# EAGLE design LCD_Breakout (EAGLE 7.6.0)
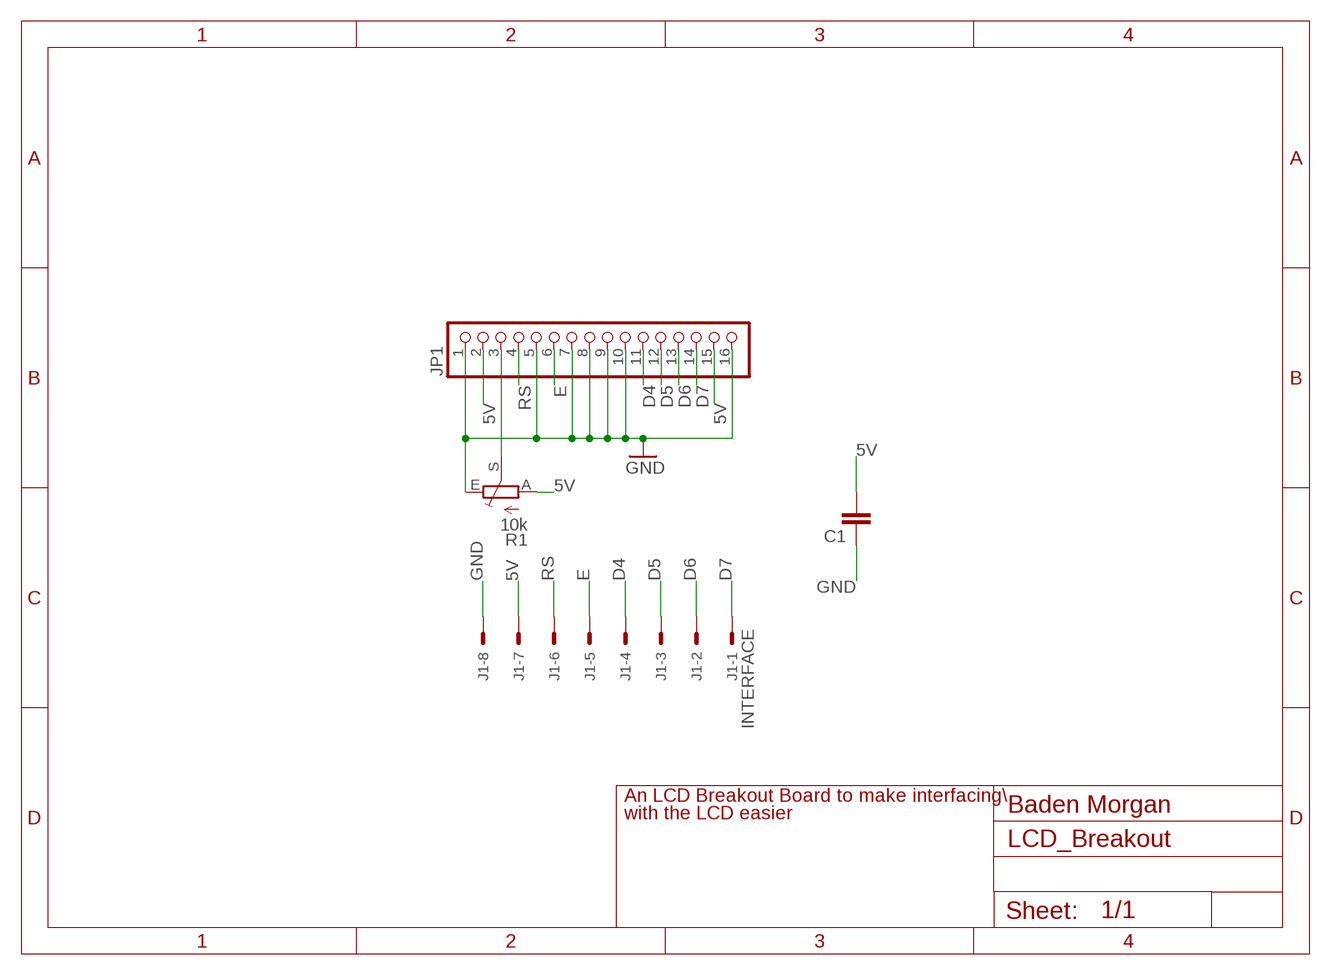
[diagram p0: schematic, sheet 1]

## Parts
C1  C5/2.5  [C5B2.5]
J1  INTERFACE  22-05-7088-08  [7395-08]
JP1  PINHD-1X16  [1X16]
R1  10k  TRIM_EU-CA6V  [CA6V]

## Nets
5V: C1.2 J1.7 JP1.2 JP1.15 R1.A
D4: J1.4 JP1.11
D5: J1.3 JP1.12
D6: J1.2 JP1.13
D7: J1.1 JP1.14
E: J1.5 JP1.6
GND: C1.1 J1.8 JP1.1 JP1.5 JP1.7 JP1.8 JP1.9 JP1.10 JP1.16 R1.E
N$3: JP1.3 R1.S
RS: J1.6 JP1.4

## Notes on the sheet
- An LCD Breakout Board to make interfacing\
- Baden Morgan
- with the LCD easier

## Library data of the parts
C1 = capacitor-wima:C: CAPACITOR naming: grid - package width
J1 = con-molex:22-?-08: CONNECTOR wire to board 2.54 mm (.1 inch) pitch header; OC_FARNELL: unknown; OC_NEWARK: unknown
JP1 = pinhead:PINHD-1X16: PIN HEADER
R1 = pot:TRIM_EU-: POTENTIOMETER

## Board
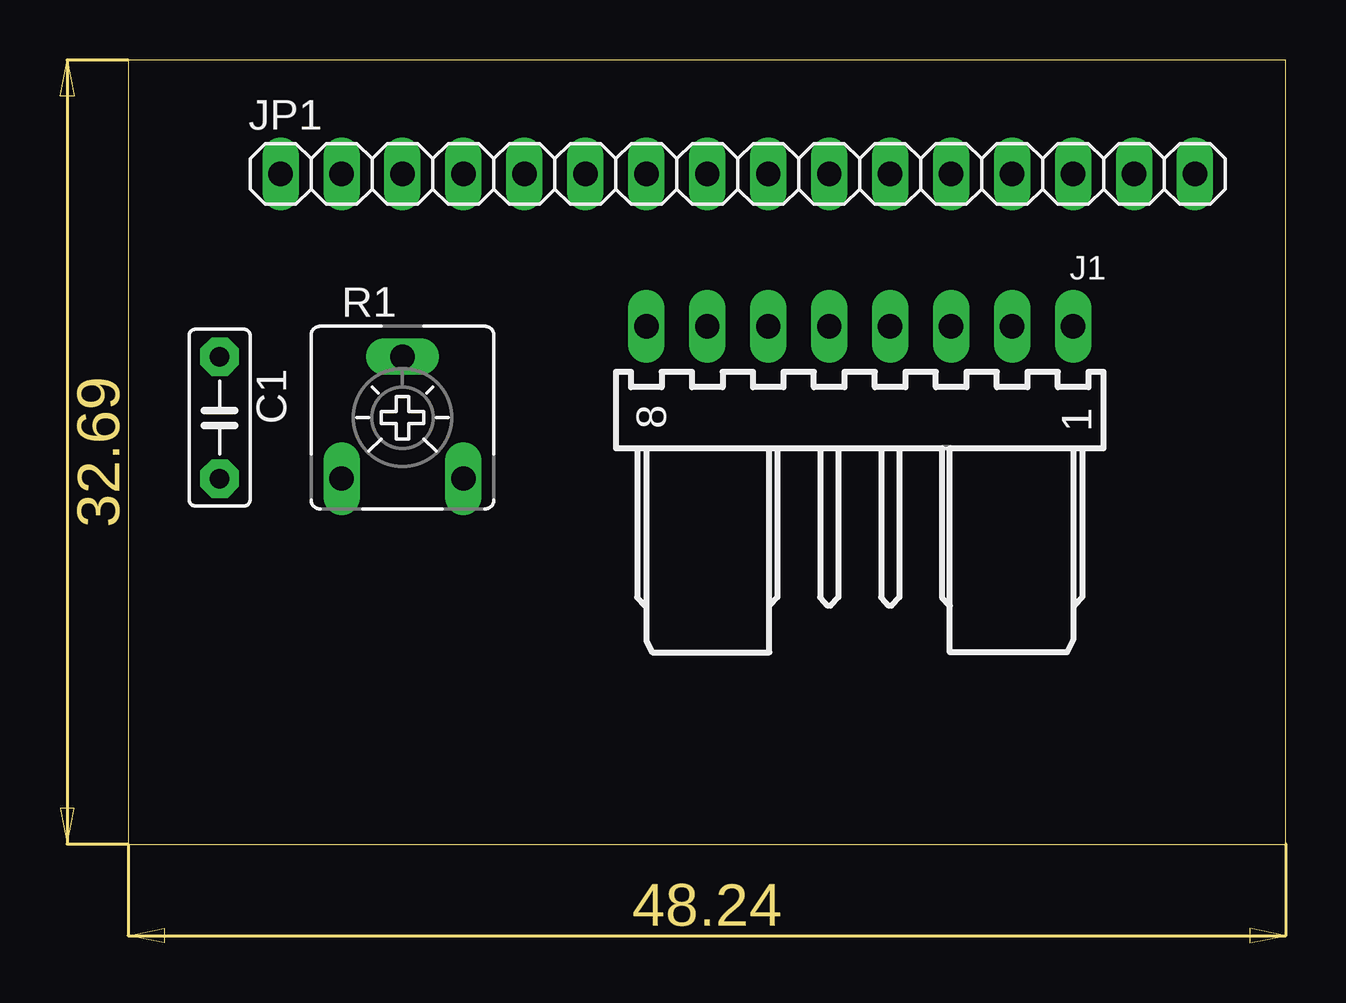
[diagram p1: board, top side]
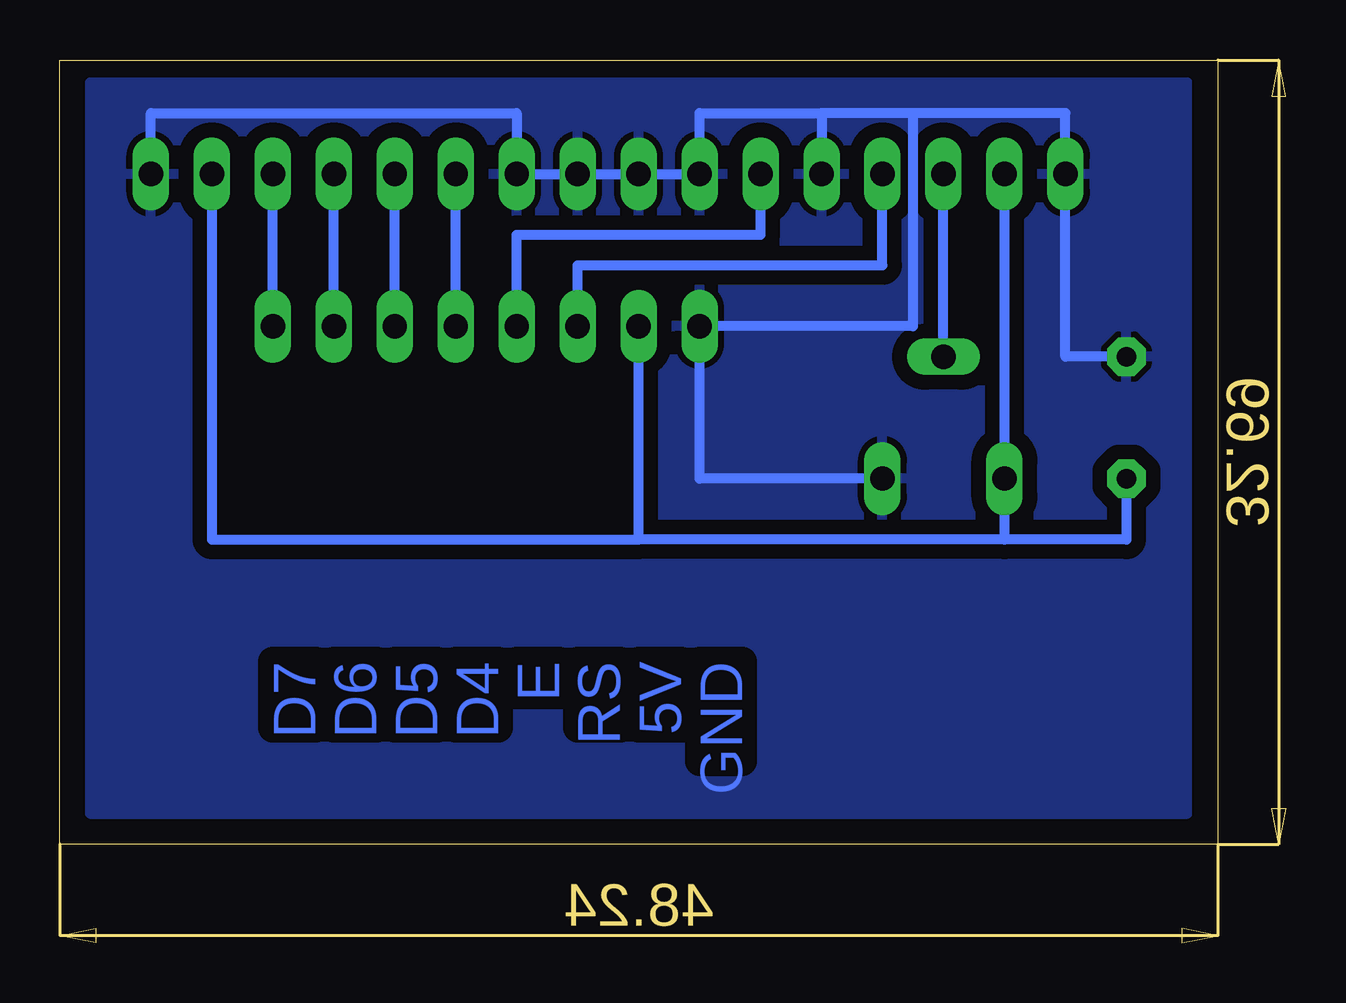
[diagram p2: board, bottom side, seen from below]

Size 48.24 x 32.69 mm. Coordinates in mm from the lower left corner, seen from the top.
Outline: 0,0 48.24,0 48.24,32.69 0,32.69 0,0
Copper layers (1*16): Top 0.035mm / dielectric 1.5mm / Bottom 0.035mm
Design rules "default": minimum track width 10mil, minimum drill 0.3mm, track to track 0.25mm, track to pad 0.25mm, pad to pad 0.25mm, via to via 0.25mm, smd to smd 0.25mm, copper to edge 0.5mm, drill to drill 0.35mm, minimum pad ring 10mil, minimum via ring 8mil, stop-mask expansion 4mil, vias tented up to drill 0mil, thermal gap 10mil

### Footprints (pad centres in the part's own frame; a part is rotated, then mirrored left to right if it is on the bottom)
C5B2.5 = drill 0.813 pad 1.6 octagon: 1 -2.54,0; 2 2.54,0
7395-08 = drill 1.016 long: 1 8.89,0; 2 6.35,0; 3 3.81,0; 4 1.27,0; 5 -1.27,0; 6 -3.81,0; 7 -6.35,0; 8 -8.89,0
1X16 = drill 1.016 long: 1 -19.05,0; 2 -16.51,0; 3 -13.97,0; 4 -11.43,0; 5 -8.89,0; 6 -6.35,0; 7 -3.81,0; 8 -1.27,0; 9 1.27,0; 10 3.81,0; 11 6.35,0; 12 8.89,0; 13 11.43,0; 14 13.97,0; 15 16.51,0; 16 19.05,0
CA6V = drill 1.016 long: A -2.54,-2.54; E 2.54,-2.54; S 0,2.54

### Placement (x,y rotation side)
C1  3.81,17.78 270 top
J1  30.48,21.59 0 top
JP1  25.4,27.94 0 top
R1  11.43,17.78 0 top

### Tracks (layer width: path | path; a pad name or v marks a point on that pad's centre or on a via)
5V
  Bottom 0.406: 8.89,12.7 R1.A JP1.2 | 8.89,12.7 24.13,12.7 | 24.13,12.7 J1.7 | JP1.15 41.91,12.7 24.13,12.7 | C1.2 3.81,12.7 8.89,12.7
D4
  Bottom 0.406: J1.4 JP1.11
D5
  Bottom 0.406: J1.3 JP1.12
D6
  Bottom 0.406: J1.2 JP1.13
D7
  Bottom 0.406: J1.1 JP1.14
E
  Bottom 0.406: J1.5 29.21,25.4 19.05,25.4 JP1.6
GND
  Bottom 0.406: R1.E 21.59,15.24 J1.8 12.7,21.59 12.7,30.48 | 12.7,30.48 6.35,30.48 JP1.1 6.35,20.32 C1.1 | JP1.16 44.45,30.48 29.21,30.48 JP1.10 JP1.9 JP1.8 JP1.7 21.59,30.48 16.51,30.48 | 16.51,30.48 JP1.5 | 12.7,30.48 16.51,30.48
  pour Bottom (isolate 0.61): 1.27,31.75 46.99,31.75 46.99,1.27 1.27,1.27
N$3
  Bottom 0.406: R1.S JP1.3
RS
  Bottom 0.406: J1.6 26.67,24.13 13.97,24.13 JP1.4

### Text on the board
Bottom: GND | 5V | RS | E | D4 | D5 | D6 | D7